# EAGLE schematic RoomSensor (EAGLE 7.3.0)
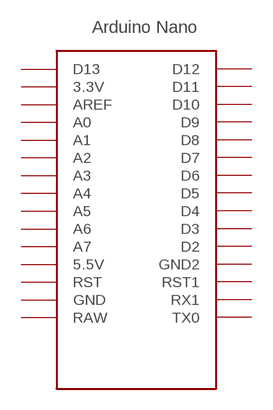
[diagram p0: schematic, sheet 1]

## Parts
U$1  NANO  [NANO]
Unconnected: U$1.3.3V U$1.5V(5.5V) U$1.A0 U$1.A1 U$1.A2 U$1.A3 U$1.A4 U$1.A5 U$1.A6 U$1.A7 U$1.AREF U$1.D2 U$1.D3 U$1.D4 U$1.D5 U$1.D6 U$1.D7 U$1.D8 U$1.D9 U$1.D10 U$1.D11 U$1.D12 U$1.D13 U$1.GND U$1.GND1(GND2) U$1.ICSP1 U$1.ICSP2 U$1.ICSP3 U$1.ICSP4 U$1.ICSP5 U$1.ICSP6 U$1.RAW U$1.RST U$1.RST1 U$1.RX1 U$1.TX0

## Library data of the parts
U$1 = Arduino-clone:NANO: Arduino Nano